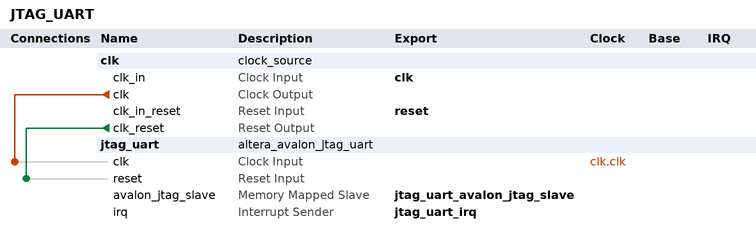
[diagram p0: system contents]
# Platform Designer (Qsys) system JTAG_UART, MAX 10 10M08SAE144C8G
# Parameters at their usual value, and those the tool derives, are not listed.
package require -exact qsys 16.1
create_system JTAG_UART
set_project_property DEVICE_FAMILY {MAX 10}
set_project_property DEVICE 10M08SAE144C8G

add_instance clk clock_source 16.1
set_instance_parameter_value clk clockFrequency 50000000

add_instance jtag_uart altera_avalon_jtag_uart 16.1
set_instance_parameter_value jtag_uart readBufferDepth 8
set_instance_parameter_value jtag_uart readIRQThreshold 1
set_instance_parameter_value jtag_uart simInteractiveOptions NO_INTERACTIVE_WINDOWS
set_instance_parameter_value jtag_uart useRegistersForReadBuffer true
set_instance_parameter_value jtag_uart useRegistersForWriteBuffer true
set_instance_parameter_value jtag_uart writeBufferDepth 16
set_instance_parameter_value jtag_uart writeIRQThreshold 1

# connections
add_connection clk.clk jtag_uart.clk clock
add_connection clk.clk_reset jtag_uart.reset reset

# exported interfaces
add_interface clk clock sink
set_interface_property clk EXPORT_OF clk.clk_in
add_interface jtag_uart_avalon_jtag_slave avalon slave
set_interface_property jtag_uart_avalon_jtag_slave EXPORT_OF jtag_uart.avalon_jtag_slave
add_interface jtag_uart_irq interrupt sender
set_interface_property jtag_uart_irq EXPORT_OF jtag_uart.irq
add_interface reset reset sink
set_interface_property reset EXPORT_OF clk.clk_in_reset

set_interconnect_requirement {$system} qsys_mm.clockCrossingAdapter HANDSHAKE
set_interconnect_requirement {$system} qsys_mm.enableEccProtection FALSE
set_interconnect_requirement {$system} qsys_mm.insertDefaultSlave FALSE
set_interconnect_requirement {$system} qsys_mm.maxAdditionalLatency 1

save_system JTAG_UART.qsys
